# Altium schematic sheet USB.SchDoc
size A4; SheetNumber: 4; SheetTotal: 7
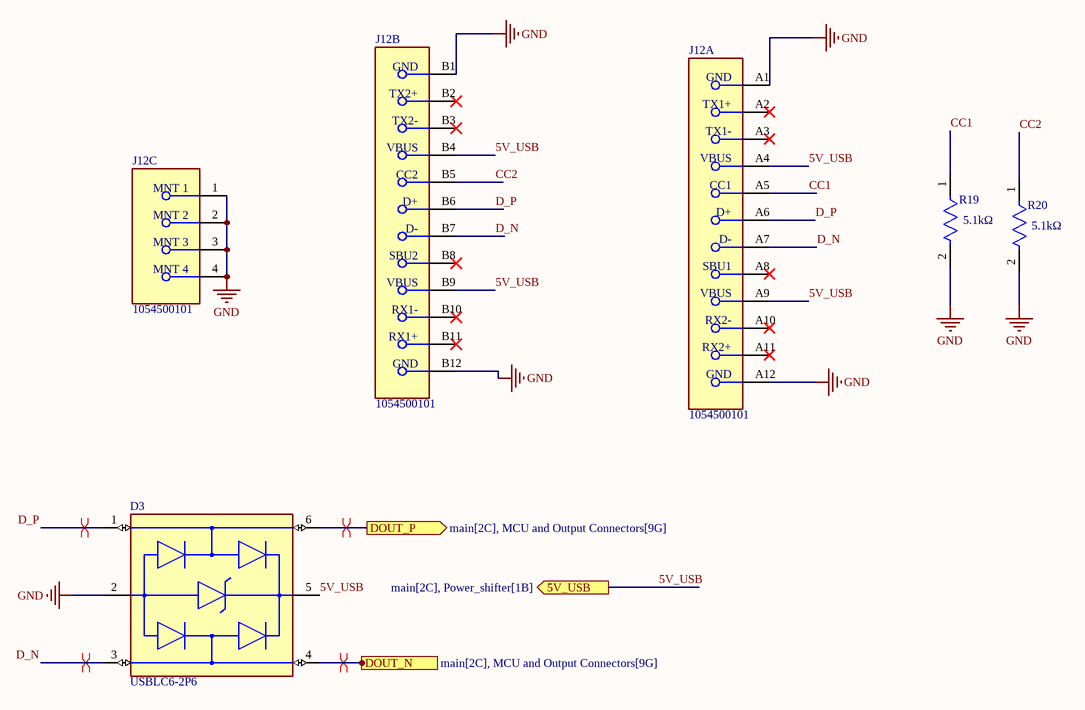
[diagram p0: USB.SchDoc]

## Parts
D3  USBLC6-2P6  [FP-SOT-666-MFG]
J12  1054500101  [FP-1054500101-MFG]  (parts A,B,C of 3)
R19  Resistance: 5.1kΩ  [FP-MCWR04-IPC_C]  (hidden comment: MCWR04X5101FTL)
R20  Resistance: 5.1kΩ  [FP-MCWR04-IPC_C]  (hidden comment: MCWR04X5101FTL)

## Ports
5V_USB (out, see main[2C], Power_shifter[1B]), DOUT_N (out, see main[2C], MCU and Output Connectors[9G]), DOUT_P (out, see main[2C], MCU and Output Connectors[9G])

## Nets
GND: D3.2(GND) J12.1(MNT_1) J12.2(MNT_2) J12.3(MNT_3) J12.4(MNT_4) J12.A1(GND) J12.A12(GND) J12.B1(GND) J12.B12(GND) R19.2 R20.2
5V_USB: D3.5(VBUS) J12.A4(VBUS) J12.A9(VBUS) J12.B4(VBUS) J12.B9(VBUS) ; port 5V_USB
CC1: J12.A5(CC1) R19.1
CC2: J12.B5(CC2) R20.1
D_N: D3.3(I/O2) J12.A7(D-) J12.B7(D-)
D_P: D3.1(I/O1) J12.A6(D+) J12.B6(D+)
DOUT_N: D3.4(I/O2) ; port DOUT_N
DOUT_P: D3.6(I/O1) ; port DOUT_P

Not connected (* = marked no-connect by the designer): J12 A2(TX1+)* A3(TX1-)* A8(SBU1)* A10(RX2-)* A11(RX2+)* B2(TX2+)* B3(TX2-)* B8(SBU2)* B10(RX1-)* B11(RX1+)*

## Layout directives
differential pair: D_N, D_P, DOUT_N, DOUT_P

## Library data of the parts
D3 = CMP-12225-000058-1: TVS DIODE 5.25V 17V SOT666; Min Breakdown Voltage: 6V; Power Line Protection: Yes; Element Configuration: Dual; Test Current: 1mA; Working Voltage: 5V; Number of Channels: 2; Max Reverse Leakage Current: 150nA; Direction: Unidirectional; Peak Pulse Current: 5A; Number of Elements: 1; Capacitance: 3.5pF; Max Breakdown Voltage: 6V; Height: 0.6mm; Depth: 1.3mm; Contact Plating: Tin; Reverse Breakdown Voltage: 6V; REACH SVHC: No SVHC; Operating Supply Voltage: 5V; Width: 1.3mm; Max Operating Temperature: 125°C; Reverse Standoff Voltage: 5V; ESD Protection: Yes; Package Quantity: 1; Termination: SMD/SMT; Length: 1.7mm; Leakage Current: 150nA; Number of Bidirectional Channels: 2; Case/Package: SOT-666; Min Operating Temperature: -40°C; Number of Pins: 6; Clamping Voltage: 17V; Breakdown Voltage: 6V; Lead Free: Lead Free; Radiation Hardening: No; Packaging: Tape and Reel; Mount: Surface Mount; Polarity: Unidirectional
J12 = CMP-04767-000004-1: CONN RCP USB3.1 TYPEC 24P SMD RA; Manufacturer: Molex; Number Of Contacts: 24; Voltage Rating: 30V; Shielding: true; Is Female: yes; Current Rating: 0.25/1.25/5A; Pitch: 0.5mm; Conn Orientation: Right Angle; Package: 0; Height: 3.44mm; Footprint Url: https://www.molex.com/pdm_docs/sd/1054500101_sd.pdf; Device Class L1: Connectors; Category: Conn; Device Class L2: USB Connectors; Digikey Description: CONN RCP USB3.1 TYPEC 24P SMD RA; Contact Material: Gold,Nickel; Mouser Description: USB Shielded I/O Receptacle; Type C; Right Angle; Surface Mount; Gold over Nickel; ComponentLink2Description: Datasheet; Lead Free: Yes; Automotive: No; Temperature Range High: +85°C; RoHS: TRUE; Octopart: https://octopart.com/105450-0101-molex-68082325; ComponentLink2URL: https://www.molex.com/webdocs/datasheets/pdf/en-us/1054500101_IO_CONNECTORS.pdf; Temperature: -30°C to +85°C; Usb Standard: USB 3.1; Temperature Range Low: -30°C; Device Class L3: unset; Manufacturer Part Number: 1054500101
R19 R20 = CMP-12256-000001-1: RES 5.1 kohm, 62.5 mW, 1%, 50 V; Manufacturer: Multicomp Pro; Value: 5.1kΩ; Voltage Rating: 50V; Power Rating: 62.5mW; Temperature Coefficient: 100ppm/°C; ComponentLink2Description: Datasheet; Lead Free: Yes; Device Class L1: Passive Components; Ambient Temperature Range High: +125°C; Manufacturer Part Number: MCWR04X5101FTL; Octopart: https://octopart.com/mcwr04x5101ftl-multicomp-50550258; Tolerance: 1%; Category: Res; Device Class L2: Resistors; Device Class L3: Chip SMD Resistors; Ambient Temperature Range Low: -55°C; Height: 0.4mm; Composition: Thick Film; ComponentLink2URL: http://www.farnell.com/datasheets/2860681.pdf; Ipc Land Pattern Name: RESC10050X35; Package: MCWR04; RoHS: TRUE; Automotive: No; Series: MCWR